# EAGLE design Elektor (EAGLE 5.11)
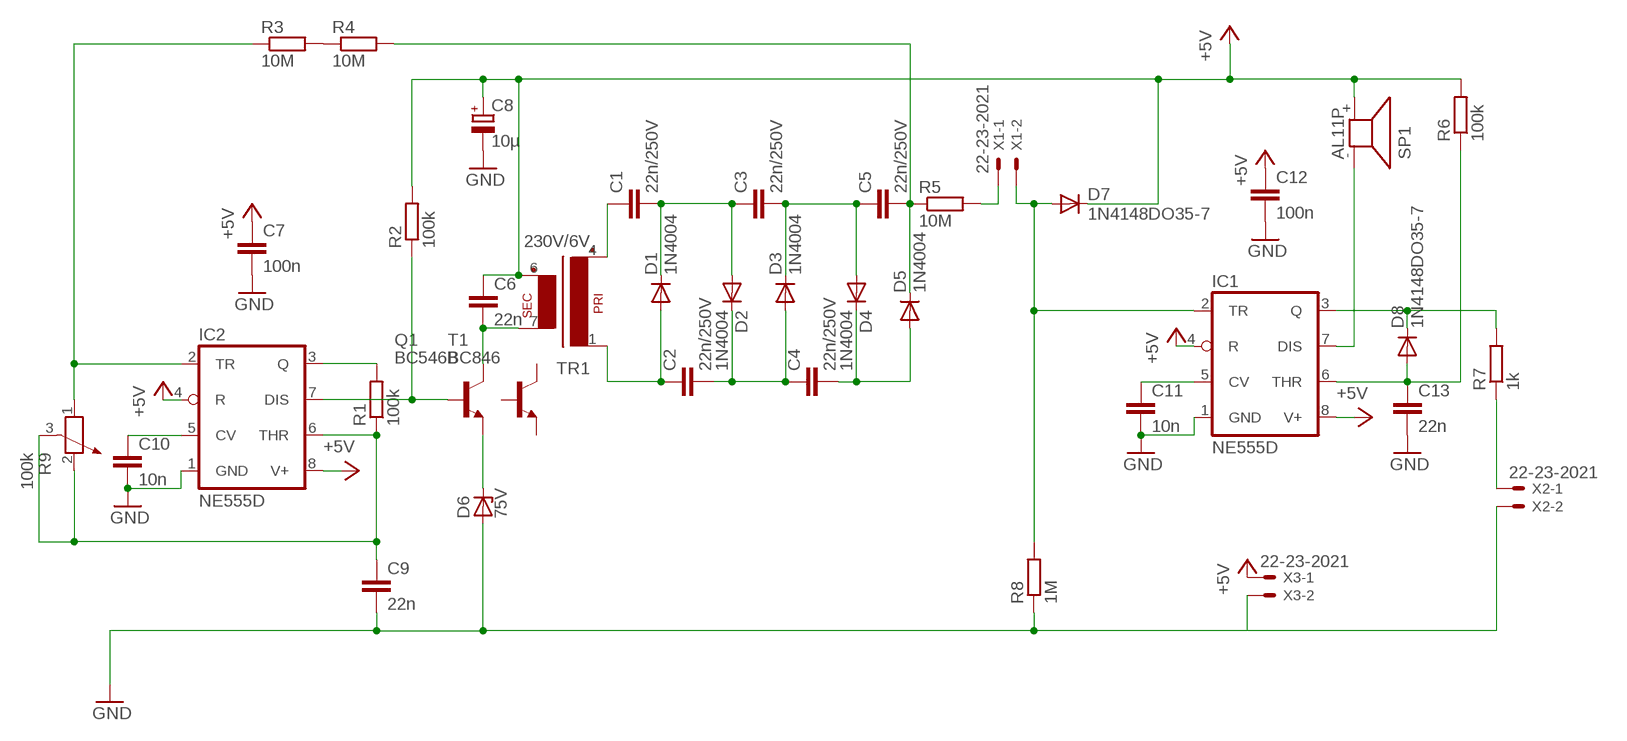
[diagram p0: schematic, sheet 1]

## Parts
C1  22n/250V  C-EU102-043X133  [C102-043X133]
C2  22n/250V  C-EU102-043X133  [C102-043X133]
C3  22n/250V  C-EU102-043X133  [C102-043X133]
C4  22n/250V  C-EU102-043X133  [C102-043X133]
C5  22n/250V  C-EU102-043X133  [C102-043X133]
C6  22n  C-EUC0805  [C0805]
C7  100n  C-EUC0805  [C0805]
C8  10µ  CPOL-EU085CS-1AR  [085CS_1AR]
C9  22n  C-EUC0805  [C0805]
C10  10n  C-EUC0805  [C0805]
C11  10n  C-EUC0805  [C0805]
C12  100n  C-EUC0805  [C0805]
C13  22n  C-EUC0805  [C0805]
D1  1N4004  [DO41-10]
D2  1N4004  [DO41-10]
D3  1N4004  [DO41-10]
D4  1N4004  [DO41-10]
D5  1N4004  [DO41-10]
D6  75V  ZENER-DIODEC1702-15  [C1702-15]
D7  1N4148DO35-7  [DO35-7]
D8  1N4148DO35-7  [DO35-7]
IC1  NE555D  [SO08]
IC2  NE555D  [SO08]
Q1  BC546B  [TO92-EBC]
R1  100k  R-EU_R0805  [R0805]
R2  100k  R-EU_R0805  [R0805]
R3  10M  R-EU_R0805  [R0805]
R4  10M  R-EU_R0805  [R0805]
R5  10M  R-EU_R0805  [R0805]
R6  100k  R-EU_R0805  [R0805]
R7  1k  R-EU_R0805  [R0805]
R8  1M  R-EU_R0805  [R0805]
R9  100k  POTENTIOMETER_PT-10  [PT-10]
SP1  AL11P  [AL11P]
T1  BC846  [SOT23]
TR1  230V/6V  EE20-1  [EE20-1]
X1  22-23-2021  [22-23-2021]
X2  22-23-2021  [22-23-2021]
X3  22-23-2021  [22-23-2021]

## Nets
+5V: C6.1 C7.1 C8.+ C12.1 D7.C IC1.4(R) IC1.8(V+) IC2.4(R) IC2.8(V+) R2.2 R6.2 SP1.+ TR1.6(S3) X3.1
GND: C7.2 C8.- C9.2 C10.2 C11.2 C12.2 C13.2 D6.A IC1.1(GND) IC2.1(GND) R8.1 X2.2 X3.2
N$1: C4.2 D4.C D5.A
N$2: C3.2 C5.1 D3.C D4.A
N$3: C2.2 C4.1 D2.C D3.A
N$4: C1.2 C3.1 D1.C D2.A
N$5: C1.1 TR1.4(P2)
N$6: C2.1 D1.A TR1.1
N$7: C5.2 D5.C R4.2 R5.1
N$8: D6.C Q1.E
N$9: C6.2 Q1.C TR1.7(S4)
N$10: IC2.7(DIS) Q1.B R2.1
N$11: IC2.2(TR) R3.1 R9.1
N$12: C11.1 IC1.5(CV)
N$13: C9.1 IC2.6(THR) R1.1 R9.2 R9.3
N$14: IC2.3(Q) R1.2
N$15: R3.2 R4.1
N$16: C10.1 IC2.5(CV)
N$17: R5.2 X1.1
N$18: D7.A IC1.2(TR) R8.2 X1.2
N$19: D8.C IC1.3(Q) R7.2
N$20: R7.1 X2.1
N$21: C13.1 D8.A IC1.6(THR) R6.1
N$24: IC1.7(DIS) SP1.-
Unconnected: T1.1(B) T1.2(E) T1.3(C)

## Library data of the parts
C1-C7 C9-C13 = rcl:C-EU: CAPACITOR, European symbol
C8 = rcl:CPOL-EU: POLARIZED CAPACITOR, European symbol
D1-D5 = diode:1N4004: DIODE general purpose rectifier, 1 A
D6 = diode:ZENER-DIODE: Z-Diode
D7 D8 = diode:1N4148: DIODE high speed (Philips)
IC1 IC2 = linear:*555: TIMER
Q1 = transistor-npn:BC546*: NPN Transistor
R1-R8 = resistor:R-EU_: RESISTOR, European symbol
R9 = rcl:POTENTIOMETER_: Potentiometer
SP1 = buzzer:AL11P: SPEAKER Source: Buerklin; OC_FARNELL: unknown; OC_NEWARK: unknown
T1 = transistor:BC846: NPN TRANSISTOR
TR1 = trafo:EE20-1: TRANSFORMER 1 primary winding, 1 secondary winding ERA
X1-X3 = con-molex:22-23-2021: .100" (2.54mm) Center Header - 2 Pin; MF: MOLEX; MPN: 22-23-2021; OC_FARNELL: 1462926; OC_NEWARK: 25C3832

## Board
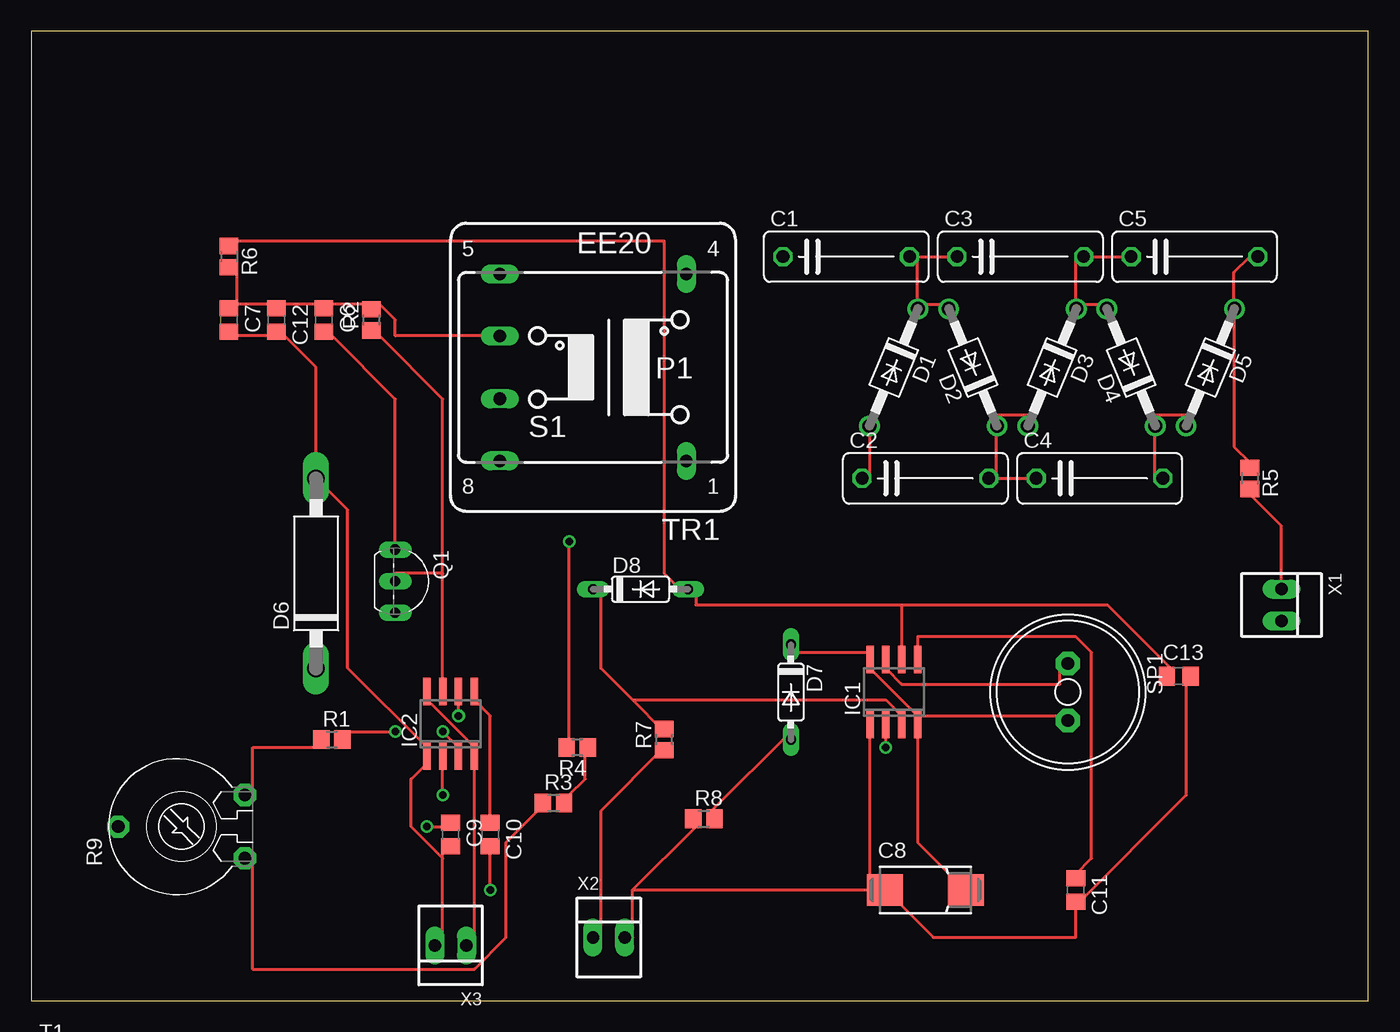
[diagram p1: board, top side]
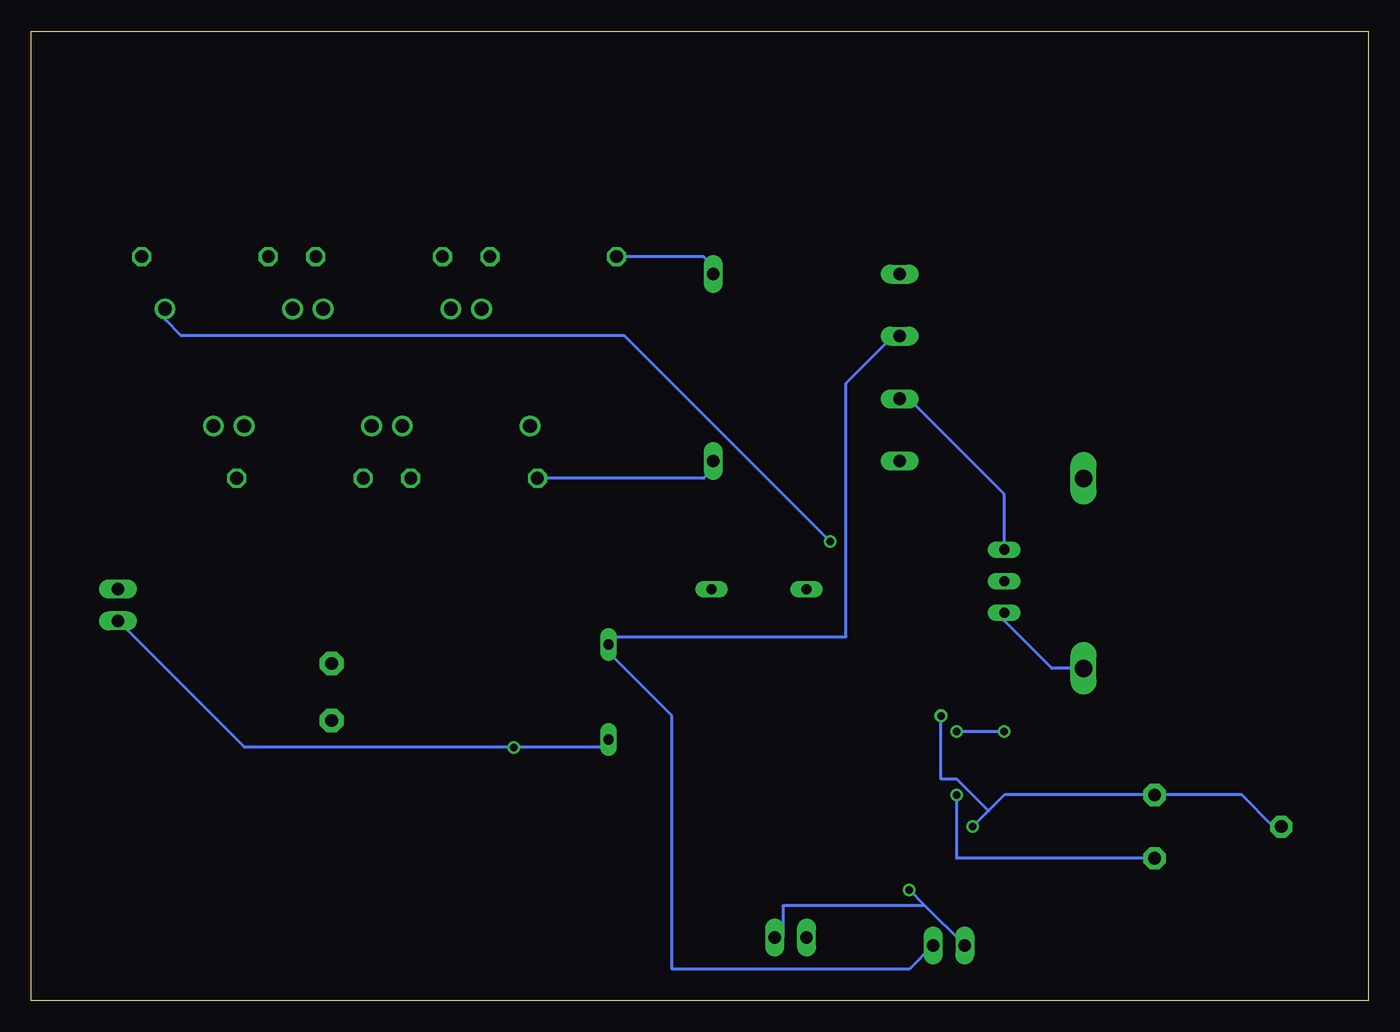
[diagram p2: board, bottom side, seen from below]

Size 107.3 x 77.78 mm. Coordinates in mm from the lower left corner, seen from the top.
Outline: 0,0 107.3,0 107.3,77.78 0,77.78 0,0
Copper layers (1*16): Top 0.035mm / dielectric 1.5mm / Bottom 0.035mm
Design rules "default": minimum track width 10mil, minimum drill 24mil, track to track 8mil, track to pad 8mil, pad to pad 8mil, via to via 8mil, smd to smd 8mil, copper to edge 40mil, drill to drill 8mil, minimum pad ring 10mil, minimum via ring 8mil, stop-mask expansion 4mil, vias tented up to drill 0mil, thermal gap 10mil

### Footprints (pad centres in the part's own frame; a part is rotated, then mirrored left to right if it is on the bottom)
C102-043X133 = drill 1.016 octagon: 1 -5.08,0; 2 5.08,0
C0805 = smd 1.3 x 1.5: 1 -0.95,0; 2 0.95,0
085CS_1AR = smd 2.9 x 2.5: + 3.25,0; - -3.25,0
DO41-10 = drill 1.118 round: A 5.08,0; C -5.08,0
C1702-15 = drill 1.397 long: A 7.62,0; C -7.62,0
DO35-7 = drill 0.813 long: A 3.81,0; C -3.81,0
SO08 = smd 0.6 x 2.2: 1 -1.905,-2.6; 2 -0.635,-2.6; 3 0.635,-2.6; 4 1.905,-2.6; 5 1.905,2.6; 6 0.635,2.6; 7 -0.635,2.6; 8 -1.905,2.6
TO92-EBC = drill 0.813 long: B 0,-1.27; C -2.54,-1.27; E 2.54,-1.27
R0805 = smd 1.3 x 1.5: 1 -0.85,0; 2 0.85,0
PT-10 = drill 1.016 pad 1.778 octagon: 1 -2.54,-5.08; 2 2.54,-5.08; 3 0,5.08
AL11P = drill 1.016 pad 1.905 octagon: + 2.286,0; - -2.286,0
SOT23 = smd 1 x 1.4: 1 -0.95,-1.1; 2 0.95,-1.1; 3 0,1.1
EE20-1 = drill 1.016 long: 1 -7.493,7.493; 4 -7.493,-7.493; 5 7.493,-7.493; 6 7.493,-2.515; 7 7.493,2.515; 8 7.493,7.493
22-23-2021 = drill 1 long: 1 -1.27,0; 2 1.27,0

### Placement (x,y rotation side)
C1  65.41,59.69 0 top
C2  71.75,41.91 0 top
C3  79.38,59.69 0 top
C4  85.72,41.91 0 top
C5  93.34,59.69 0 top
C6  23.5,54.61 270 top
C7  15.88,54.61 270 top
C8  71.75,8.89 0 top
C9  33.66,13.34 270 top
C10  36.83,13.34 270 top
C11  83.82,8.89 270 top
C12  19.68,54.61 270 top
C13  92.08,26.04 0 top
D1  69.22,50.8 247.5 top
D2  75.56,50.8 112.5 top
D3  81.92,50.8 247.5 top
D4  88.27,50.8 112.5 top
D5  94.61,50.8 247.5 top
D6  22.86,34.29 90 top
D7  60.96,24.77 270 top
D8  48.9,33.02 0 top
IC1  69.22,24.77 0 top
IC2  33.66,22.23 0 top
Q1  30.48,33.66 270 top
R1  24.13,20.95 0 top
R2  27.3,54.61 90 top
R3  41.91,15.88 0 top
R4  43.81,20.32 180 top
R5  97.79,41.91 270 top
R6  15.88,59.69 270 top
R7  50.8,20.95 90 top
R8  53.98,14.61 0 top
R9  12.06,13.97 90 top
SP1  83.19,24.77 270 top
T1  2.54,-5.08 0 top  (outside the outline)
TR1  45.09,50.8 180 top
X1  100.33,31.75 270 top
X2  46.35,5.08 0 top
X3  33.66,4.45 180 top

### Tracks (layer width: path | path; a pad name or v marks a point on that pad's centre or on a via)
+5V
  Top 0.254: 16.51,55.88 16.51,58.42 R6.2 | 16.51,55.88 19.05,55.88 C12.1 20.32,55.88 22.86,55.88 C6.1 24.13,55.88 26.67,55.88 R2.2 27.94,55.88 29.21,54.61 29.21,53.34 36.83,53.34 TR1.6 | 16.51,55.88 C7.1 | IC2.8 31.75,24.13 35.56,20.32 IC2.4 35.56,5.08 X3.1 | 60.96,29.21 D7.C 60.96,27.94 67.31,27.94 IC1.8 67.31,26.67 71.12,22.86 | 76.2,8.89 C8.+ 74.93,8.89 71.12,12.7 IC1.4 71.12,22.86 | 71.12,22.86 82.55,22.86 SP1.+
  Bottom 0.254: X3.1 36.83,2.54 55.88,2.54 55.88,22.86 60.96,27.94 D7.C 60.96,29.21 41.91,29.21 41.91,49.53 38.1,53.34 TR1.6
GND  (via drill 0.61)
  Top 0.254: C7.2 16.51,53.34 19.05,53.34 C12.2 20.32,53.34 22.86,50.8 D6.A 25.4,39.37 25.4,26.67 31.75,20.32 IC2.1 31.75,19.05 30.48,17.78 30.48,13.97 33.02,11.43 | 48.26,8.89 53.34,13.97 R8.1 | 48.26,8.89 48.26,5.08 X2.2 | 33.02,11.43 33.02,5.08 X3.2 | 33.02,11.43 33.02,12.7 C9.2 | v36.83,8.89 C10.2 36.83,12.7 | 48.26,8.89 67.31,8.89 | 67.31,8.89 IC1.1 | 67.31,8.89 C8.- 68.58,8.89 72.39,5.08 83.82,5.08 83.82,7.62 | 83.82,7.62 92.71,16.51 92.71,25.4 C13.2 | 83.82,7.62 C11.2
  Bottom 0.254: 35.56,7.62 v36.83,8.89 | X3.2 35.56,7.62 | 35.56,7.62 46.99,7.62 46.99,5.08 X2.2
N$1
  Top 0.254: C4.2 90.17,41.91 90.17,45.72 D4.C 90.17,46.99 92.71,46.99 D5.A
N$2
  Top 0.254: 83.82,55.88 86.36,55.88 D4.A | C5.1 C3.2 83.82,59.69 83.82,55.88 | D3.C 83.82,55.88
N$3
  Top 0.254: D3.A 80.01,46.99 77.47,46.99 D2.C 77.47,45.72 77.47,41.91 | 77.47,41.91 C4.1 | C2.2 77.47,41.91
N$4
  Top 0.254: 71.12,55.88 73.66,55.88 D2.A | 71.12,59.69 C3.1 | 71.12,55.88 71.12,59.69 | D1.C 71.12,55.88 | 71.12,59.69 C1.2
N$5
  Bottom 0.254: TR1.4 52.07,58.42 53.34,59.69 C1.1
N$6
  Top 0.254: D1.A 67.31,45.72 67.31,41.91 C2.1
  Bottom 0.254: TR1.1 52.07,43.18 53.34,41.91 C2.1
N$7  (via drill 0.61)
  Top 0.254: v43.18,36.83 43.18,20.32 R4.2 | C5.2 97.79,59.69 96.52,58.42 96.52,55.88 D5.C 96.52,54.61 96.52,44.45 97.79,43.18 R5.1
  Bottom 0.254: v43.18,36.83 59.69,53.34 95.25,53.34 96.52,54.61 D5.C
N$8
  Bottom 0.254: D6.C 25.4,26.67 29.21,30.48 Q1.E
N$9
  Top 0.254: C6.2 24.13,53.34 29.21,48.26 Q1.C
  Bottom 0.254: TR1.7 36.83,48.26 29.21,40.64 Q1.C
N$10
  Top 0.254: 33.02,34.29 33.02,48.26 27.94,53.34 R2.1 | IC2.7 33.02,34.29 | 33.02,34.29 29.21,34.29 Q1.B
N$11  (via drill 0.61)
  Top 0.254: R3.1 40.64,15.24 38.1,12.7 38.1,5.08 35.56,2.54 17.78,2.54 17.78,11.43 R9.1 | v33.02,16.51 IC2.2
  Bottom 0.254: v33.02,16.51 33.02,11.43 R9.1
N$12
  Top 0.254: C11.1 83.82,10.16 85.09,11.43 85.09,27.94 83.82,29.21 71.12,29.21 IC1.5
N$13  (via drill 0.61)
  Top 0.254: R1.1 22.86,20.32 17.78,20.32 17.78,16.51 R9.2 | v31.75,13.97 33.02,13.97 C9.1 | v34.29,22.86 IC2.6
  Bottom 0.254: 30.48,15.24 29.21,16.51 R9.2 10.16,16.51 7.62,13.97 R9.3 | 30.48,15.24 v31.75,13.97 | v34.29,22.86 34.29,17.78 33.02,17.78 30.48,15.24
N$14  (via drill 0.61)
  Top 0.254: v29.21,21.59 25.4,21.59 R1.2 | v33.02,21.59 34.29,20.32 IC2.3
  Bottom 0.254: v29.21,21.59 v33.02,21.59
N$15
  Top 0.254: R3.2 43.18,16.51 44.45,17.78 44.45,20.32 R4.1
N$16
  Top 0.254: 36.83,13.97 C10.1 36.83,22.86 35.56,24.13 IC2.5
N$17
  Top 0.254: X1.1 100.33,38.1 97.79,40.64 R5.2
N$18  (via drill 0.61)
  Top 0.254: R8.2 54.61,15.24 60.96,21.59 D7.A | v68.58,20.32 IC1.2
  Bottom 0.254: 60.96,21.59 D7.A 60.96,20.32 v68.58,20.32 90.17,20.32 X1.2
N$19
  Top 0.254: 48.26,24.13 45.72,26.67 45.72,33.02 D8.C | 48.26,24.13 50.8,21.59 R7.2 | 48.26,24.13 68.58,24.13 69.85,22.86 IC1.3
N$20
  Top 0.254: R7.1 50.8,20.32 45.72,15.24 45.72,5.08 X2.1
N$21
  Top 0.254: 69.85,31.75 86.36,31.75 91.44,26.67 C13.1 | 69.85,31.75 IC1.6 | R6.1 16.51,60.96 50.8,60.96 50.8,34.29 52.07,33.02 D8.A 53.34,33.02 53.34,31.75 69.85,31.75
N$24
  Top 0.254: IC1.7 68.58,26.67 69.85,25.4 82.55,25.4 82.55,26.67 SP1.-